# EAGLE design CA_kit_v02 (EAGLE 6.1)
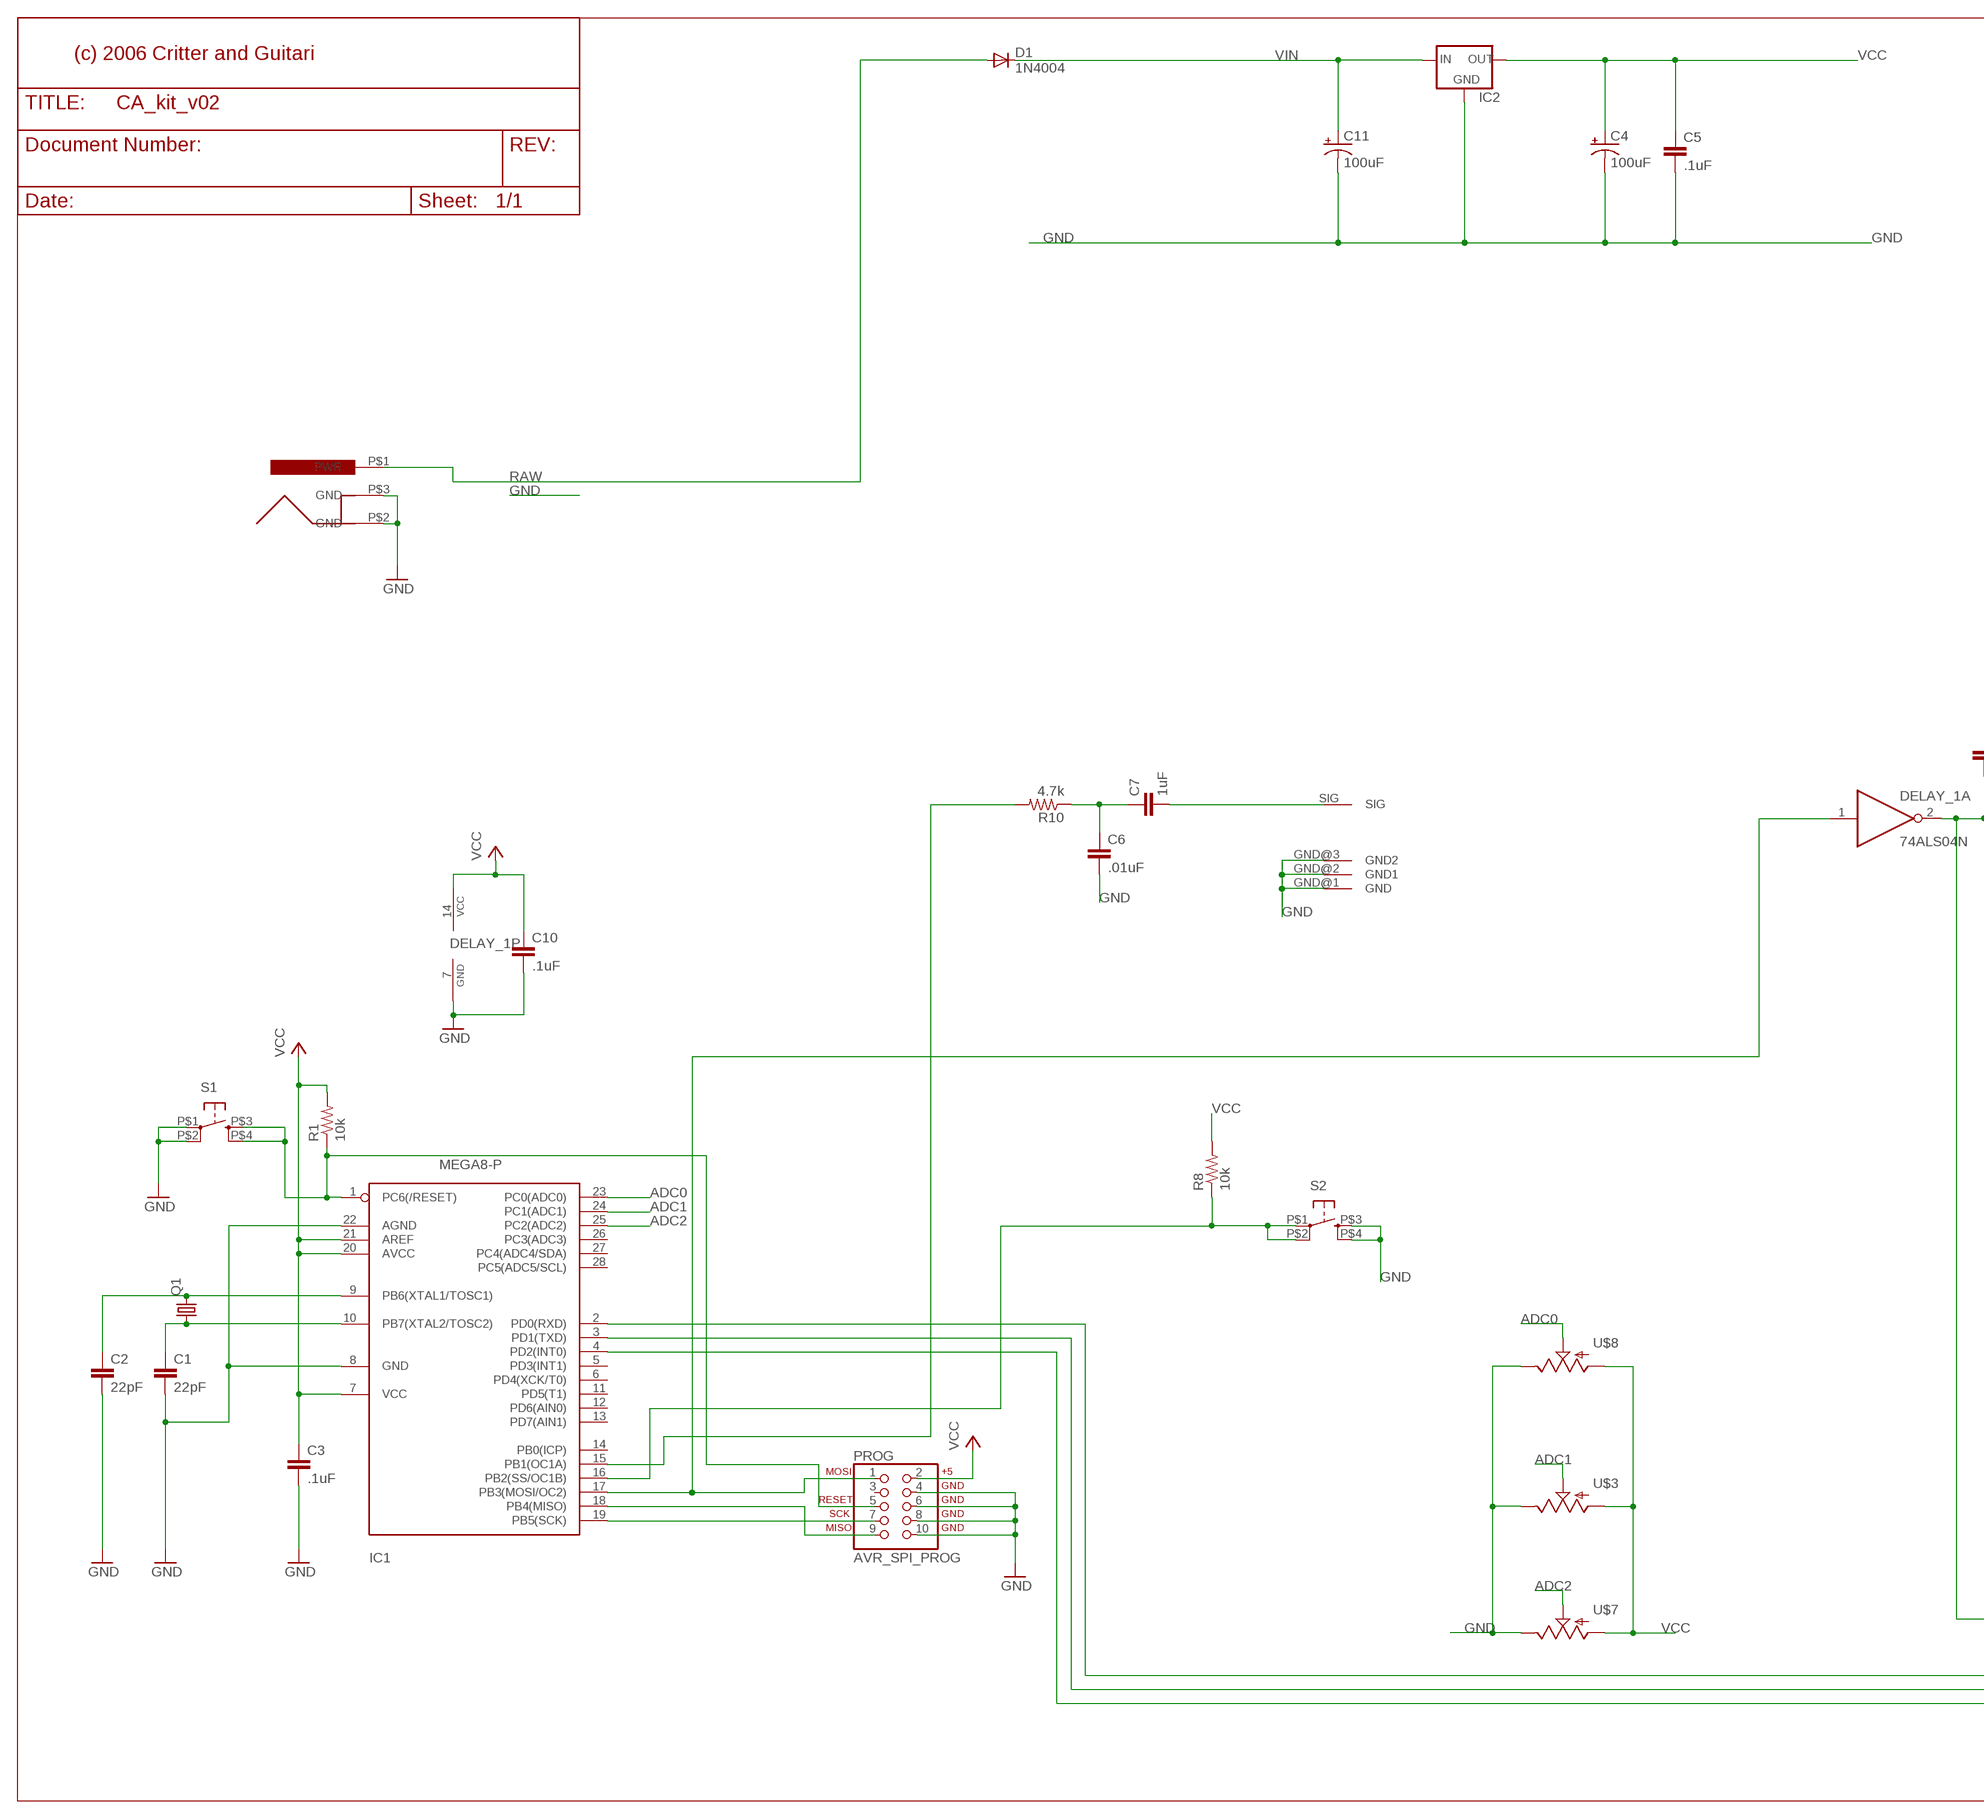
[diagram p0: schematic, sheet 1, part 1 of 2]
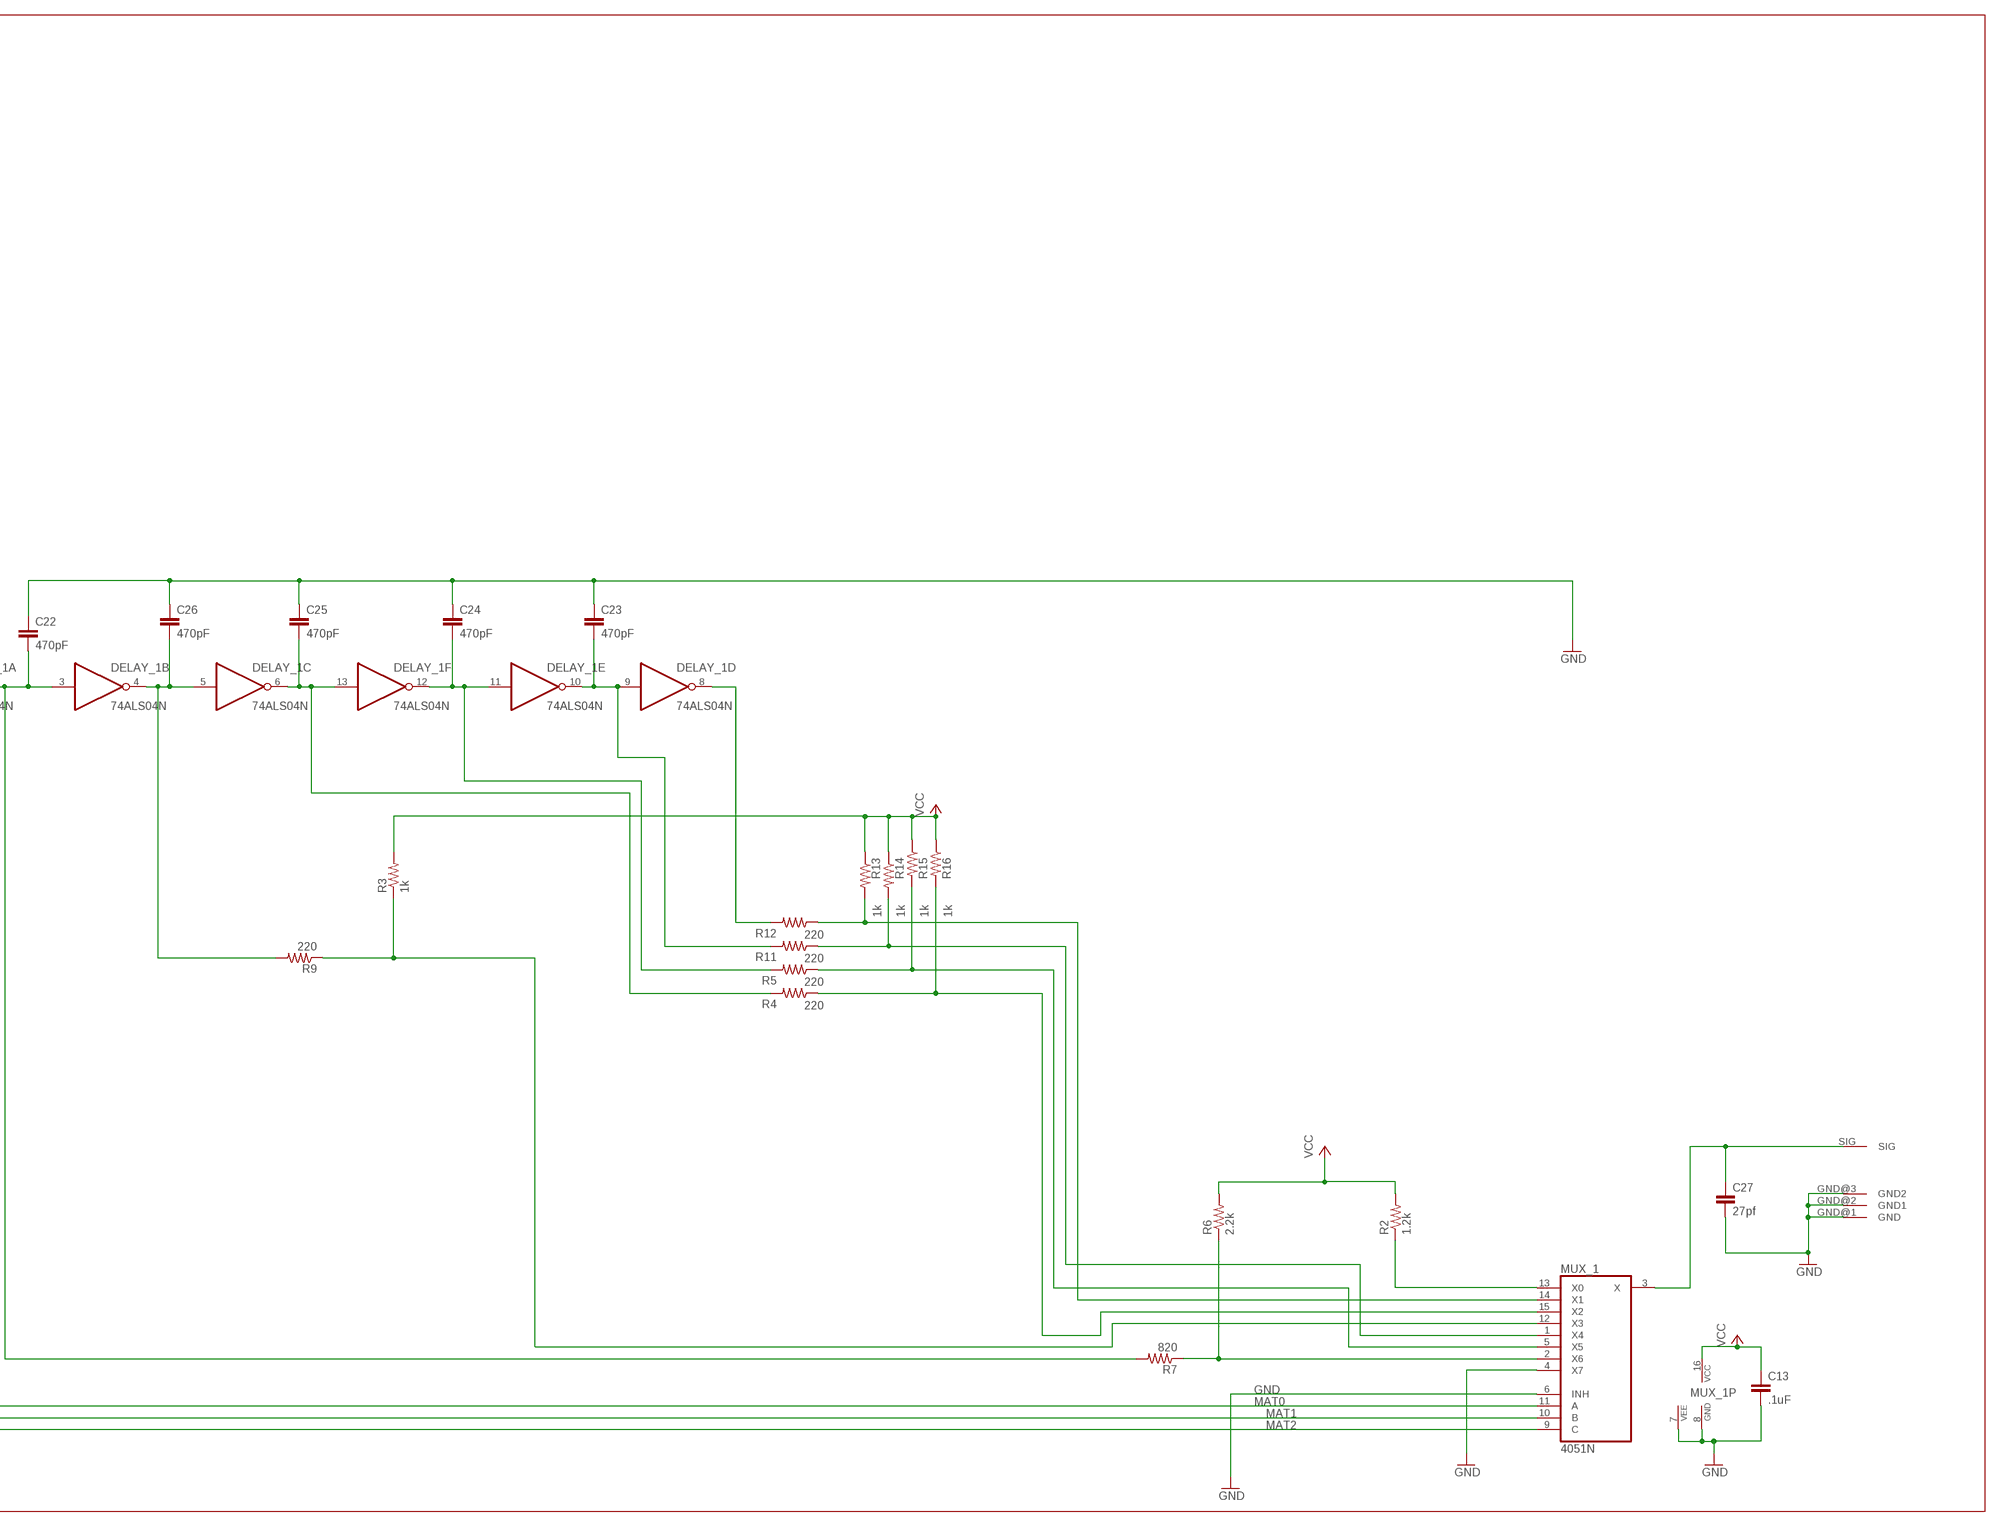
[diagram p1: schematic, sheet 1, part 2 of 2]

## Parts
C1  22pF  CAP025-025X050  [C025-025X050]
C2  22pF  CAP025-025X050  [C025-025X050]
C3  .1uF  CAP025-025X050  [C025-025X050]
C4  100uF  CPOL-USE3.5-8  [E3,5-8]
C5  .1uF  CAP025-025X050  [C025-025X050]
C6  .01uF  CAP025-025X050  [C025-025X050]
C7  1uF  CAP025-025X050  [C025-025X050]
C10  .1uF  CAP025-025X050  [C025-025X050]
C11  100uF  CPOL-USE3.5-8  [E3,5-8]
C13  .1uF  CAP025-025X050  [C025-025X050]
C22  470pF  CAP025-025X050  [C025-025X050]
C23  470pF  CAP025-025X050  [C025-025X050]
C24  470pF  CAP025-025X050  [C025-025X050]
C25  470pF  CAP025-025X050  [C025-025X050]
C26  470pF  CAP025-025X050  [C025-025X050]
C27  27pf  CAP025-025X050  [C025-025X050]
D1  1N4004  [DO41-10]
DELAY_1  74ALS04N  [DIL14]
IC1  MEGA8-P  [DIL28-3]
IC2  78XXS  [78XXS]
MUX_1  4051N  [DIL16]
PROG  AVR_SPI_PROG  [PINHEAD_2X05]
Q1  CRYSTALHC49UV  [HC49U-V]
R1  10k  RES0204V  [0204V]
R2  1.2k  RES0204V  [0204V]
R3  1k  RES0204V  [0204V]
R4  220  RES0204V  [0204V]
R5  220  RES0204V  [0204V]
R6  2.2k  RES0204V  [0204V]
R7  820  RES0204V  [0204V]
R8  10k  RES0204V  [0204V]
R9  220  RES0204V  [0204V]
R10  4.7k  RES0204V  [0204V]
R11  220  RES0204V  [0204V]
R12  220  RES0204V  [0204V]
R13  1k  RES0204V  [0204V]
R14  1k  RES0204V  [0204V]
R15  1k  RES0204V  [0204V]
R16  1k  RES0204V  [0204V]
S1  TAC_SWITCHKSA_SEALED_TAC_SWITCH  [KSA_SEALED_TAC_SWITCH]
S2  TAC_SWITCHKSA_SEALED_TAC_SWITCH  [KSA_SEALED_TAC_SWITCH]
U$1  POWER_JACK  POWER_JACKTHRU-HOLE  [POWER_JACK]
U$3  POT  [ALPS_POT]
U$5  PHONO_PLUG  [PHONO_PCB]
U$6  PHONO_PLUG  [PHONO_PCB]
U$7  POT  [ALPS_POT]
U$8  POT  [ALPS_POT]

## Nets
ADC0: IC1.23(PC0(ADC0)) U$8.P$2(S)
ADC1: IC1.24(PC1(ADC1)) U$3.P$2(S)
ADC2: IC1.25(PC2(ADC2)) U$7.P$2(S)
BURST: C22.2 DELAY_1.2(A:O) DELAY_1.3(B:I) R7.2
COLORS: DELAY_1.1(A:I) IC1.17(PB3(MOSI/OC2)) PROG.1
GND [power]: C1.2 C2.2 C3.2 C4.- C5.2 C6.2 C10.2 C11.- C13.2 C22.1 C23.1 C24.1 C25.1 C26.1 C27.2 DELAY_1.7(P:GND) IC1.8(GND) IC1.22(AGND) IC2.GND MUX_1.4(X7) MUX_1.6(INH) MUX_1.7(VEE) MUX_1.8(GND) PROG.4 PROG.6 PROG.8 PROG.10 S1.P$1(P) S1.P$2(P1) S2.P$3(S) S2.P$4(S1) U$1.P$2(GND) U$1.P$3(GND) U$3.P$1(E) U$5.GND@1(GND) U$5.GND@2(GND1) U$5.GND@3(GND2) U$6.GND@1(GND) U$6.GND@2(GND1) U$6.GND@3(GND2) U$7.P$1(E) U$8.P$1(E)
MAT0: IC1.2(PD0(RXD)) MUX_1.11(A)
MAT1: IC1.3(PD1(TXD)) MUX_1.10(B)
MAT2: IC1.4(PD2(INT0)) MUX_1.9(C)
N$1: IC1.16(PB2(SS/OC1B)) R8.1 S2.P$1(P) S2.P$2(P1)
N$2: DELAY_1.8(D:O) R12.2
N$3: C23.2 DELAY_1.9(D:I) DELAY_1.10(E:O) R11.2
N$4: C2.1 IC1.9(PB6(XTAL1/TOSC1)) Q1.2
N$5: C1.1 IC1.10(PB7(XTAL2/TOSC2)) Q1.1
N$6: IC1.15(PB1(OC1A)) R10.2
N$7: C26.2 DELAY_1.4(B:O) DELAY_1.5(C:I) R9.2
N$8: MUX_1.12(X3) R3.1 R9.1
N$9: C6.1 C7.1 R10.1
N$10 [power]: IC1.1(PC6(/RESET)) PROG.5 R1.1 S1.P$3(S) S1.P$4(S1)
N$11: C7.2 U$5.SIG
N$16: IC1.19(PB5(SCK)) PROG.7
N$17: IC1.18(PB4(MISO)) PROG.9
N$31: C25.2 DELAY_1.6(C:O) DELAY_1.13(F:I) R4.2
N$32: C24.2 DELAY_1.11(E:I) DELAY_1.12(F:O) R5.2
N$33: MUX_1.13(X0) R2.1
N$41: MUX_1.14(X1) R12.1 R13.2
N$42: MUX_1.1(X4) R11.1 R14.2
N$43: MUX_1.5(X5) R5.1 R15.2
N$44: MUX_1.15(X2) R4.1 R16.2
N$51: C27.1 MUX_1.3(X) U$6.SIG
N$55: MUX_1.2(X6) R6.1 R7.1
RAW: D1.A U$1.P$1(PWR)
VCC [power]: C3.1 C4.+ C5.1 C10.1 C13.1 DELAY_1.14(P:VCC) IC1.7(VCC) IC1.20(AVCC) IC1.21(AREF) IC2.OUT MUX_1.16(VCC) PROG.2 R1.2 R2.2 R3.2 R6.2 R8.2 R13.1 R14.1 R15.1 R16.1 U$3.P$3(A) U$7.P$3(A) U$8.P$3(A)
VIN [power]: C11.+ D1.C IC2.IN
Unconnected: IC1.5(PD3(INT1)) IC1.6(PD4(XCK/T0)) IC1.11(PD5(T1)) IC1.12(PD6(AIN0)) IC1.13(PD7(AIN1)) IC1.14(PB0(ICP)) IC1.26(PC3(ADC3)) IC1.27(PC4(ADC4/SDA)) IC1.28(PC5(ADC5/SCL)) PROG.3

## Notes on the sheet
- (c) 2006 Critter and Guitari

## Library data of the parts
C1-C3 C5-C7 C10 C13 C22-C27 = SparkFun:CAP: CAPACITOR
C4 C11 = rcl:CPOL-US: POLARIZED CAPACITOR, American symbol
D1 = diode:1N4004: DIODE general purpose rectifier, 1 A
DELAY_1 = 74xx-us:74*04: Hex INVERTER
IC1 = avr:MEGA8-P: MICROCONTROLLER 8 Kbytes FLASH 1 kbytes SRAM 512 bytes EEPROM USART 4-channel 10 bit ADC 2-channel 8 bit ADC
IC2 = v-reg:78XXS: VOLTAGE REGULATOR
MUX_1 = 40xx:4051: 8-channel ANALOG MULTIPLEXER
PROG = SparkFun:AVR_SPI_PROG: PIN HEADER
Q1 = SparkFun:CRYSTAL
R1-R16 = SparkFun:RES: RESISTOR
S1 S2 = SparkFun:TAC_SWITCH: OMRON SWITCH
U$1 = SparkFun:POWER_JACK
U$3 U$7 U$8 = sfe_owen:POT
U$5 U$6 = sfe_owen:PHONO_PLUG

## Net classes
0 default: width 0.254 mm
1 power: width 0.254 mm

## Board
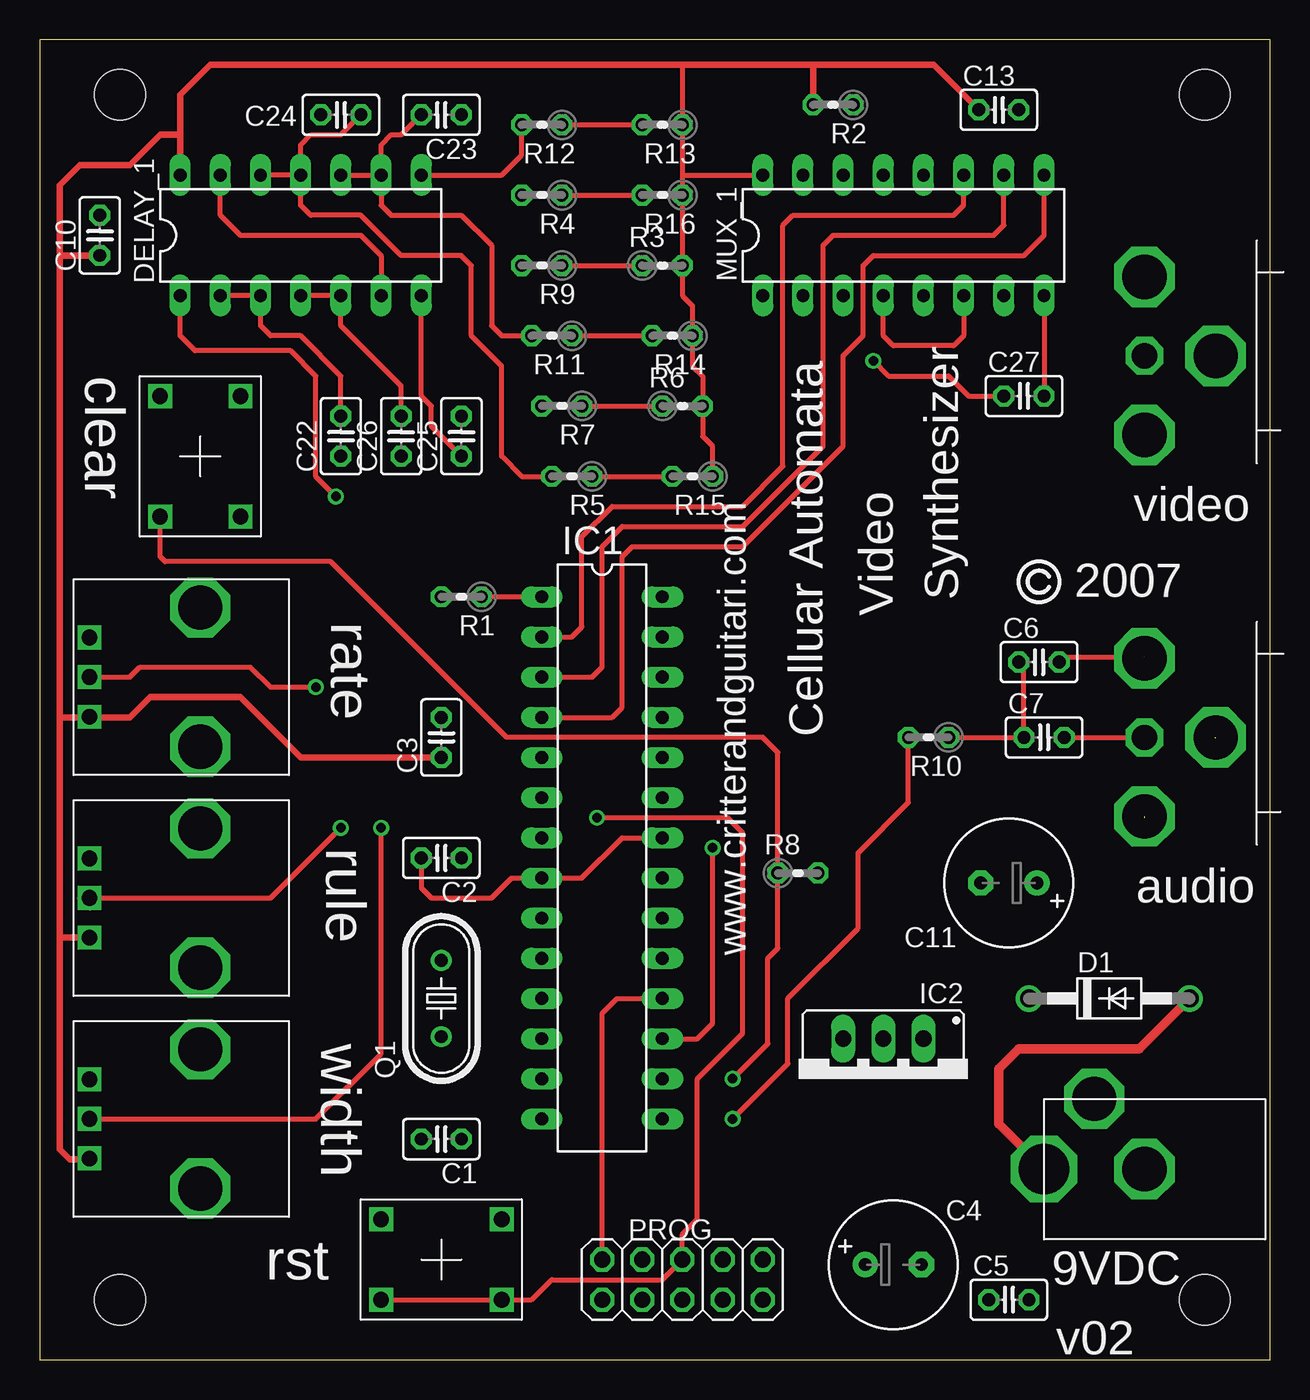
[diagram p2: board, top side]
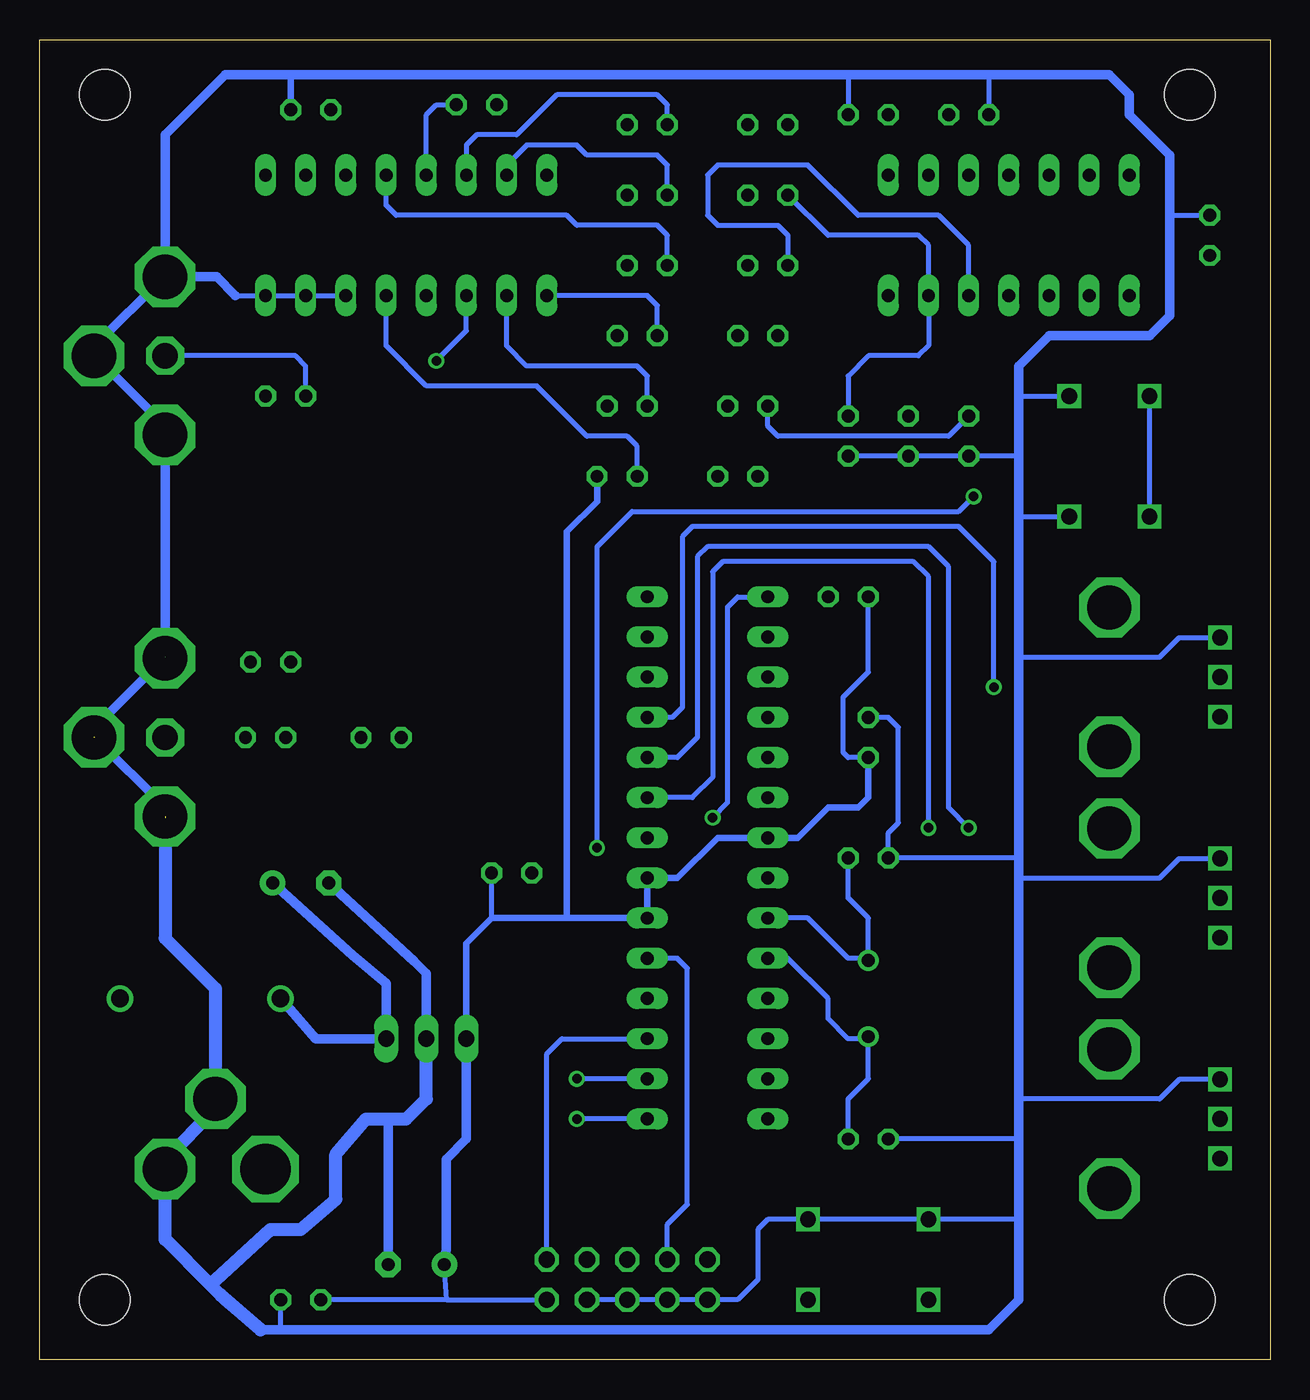
[diagram p3: board, bottom side, seen from below]

Size 77.79 x 83.5 mm. Coordinates in mm from the lower left corner, seen from the top.
Outline: 0,0 77.79,0 77.79,83.5 0,83.5 0,0
Copper layers (1*16): Top 0.0356mm / dielectric 1.5011mm / Bottom 0.0356mm
Design rules: minimum track width 12mil, minimum drill 20mil, track to track 12mil, track to pad 12mil, pad to pad 12mil, via to via 12mil, smd to smd 12mil, copper to edge 30mil, drill to drill 8mil, minimum pad ring 10mil, minimum via ring 8mil, stop-mask expansion 4mil, vias tented up to drill 0mil, thermal gap 10mil
Holes 3.2 mm at 73.66,80.01 5.08,80.01 73.66,3.81 5.08,3.81

### Footprints (pad centres in the part's own frame; a part is rotated, then mirrored left to right if it is on the bottom)
C025-025X050 = drill 0.813 octagon: 1 -1.27,0; 2 1.27,0
E3,5-8 = drill 0.813 pad 1.6: + -1.778,0 | drill 0.813 pad 1.6 octagon: - 1.778,0
DO41-10 = drill 1.118: A 5.08,0; C -5.08,0
DIL14 = drill 0.813 long: 1 -7.62,-3.81; 2 -5.08,-3.81; 3 -2.54,-3.81; 4 0,-3.81; 5 2.54,-3.81; 6 5.08,-3.81; 7 7.62,-3.81; 8 7.62,3.81; 9 5.08,3.81; 10 2.54,3.81; 11 0,3.81; 12 -2.54,3.81; 13 -5.08,3.81; 14 -7.62,3.81
DIL28-3 = drill 0.813 long: 1 -16.51,-3.81; 2 -13.97,-3.81; 3 -11.43,-3.81; 4 -8.89,-3.81; 5 -6.35,-3.81; 6 -3.81,-3.81; 7 -1.27,-3.81; 8 1.27,-3.81; 9 3.81,-3.81; 10 6.35,-3.81; 11 8.89,-3.81; 12 11.43,-3.81; 13 13.97,-3.81; 14 16.51,-3.81; 15 16.51,3.81; 16 13.97,3.81; 17 11.43,3.81; 18 8.89,3.81; 19 6.35,3.81; 20 3.81,3.81; 21 1.27,3.81; 22 -1.27,3.81; 23 -3.81,3.81; 24 -6.35,3.81; 25 -8.89,3.81; 26 -11.43,3.81; 27 -13.97,3.81; 28 -16.51,3.81
78XXS = drill 1.016 long: GND 0,-2.54; IN -2.54,-2.54; OUT 2.54,-2.54
DIL16 = drill 0.813 long: 1 -8.89,-3.81; 2 -6.35,-3.81; 3 -3.81,-3.81; 4 -1.27,-3.81; 5 1.27,-3.81; 6 3.81,-3.81; 7 6.35,-3.81; 8 8.89,-3.81; 9 8.89,3.81; 10 6.35,3.81; 11 3.81,3.81; 12 1.27,3.81; 13 -1.27,3.81; 14 -3.81,3.81; 15 -6.35,3.81; 16 -8.89,3.81
PINHEAD_2X05 = drill 1.016 octagon: 1 -1.27,5.08; 2 1.27,5.08; 3 -1.27,2.54; 4 1.27,2.54; 5 -1.27,0; 6 1.27,0; 7 -1.27,-2.54; 8 1.27,-2.54; 9 -1.27,-5.08; 10 1.27,-5.08
HC49U-V = drill 0.813: 1 -2.413,0; 2 2.413,0
0204V = drill 0.813 octagon: 1 -1.27,0; 2 1.27,0
KSA_SEALED_TAC_SWITCH = drill 1 square: P$1 -3.81,2.54; P$2 3.81,2.54; P$3 -3.81,-2.54; P$4 3.81,-2.54
POWER_JACK = drill 3.2 octagon: P$1 0,4.445 | drill 2.8 octagon: P$2 3.175,8.89; P$3 6.35,4.445
ALPS_POT = drill 1 square: P$1 7,-2.5; P$2 7,0; P$3 7,2.5 | drill 2.8 octagon: P$4 0,-4.4; P$5 0,4.4
PHONO_PCB = drill 2.8 octagon: GND@1 0,5; GND@2 0,-5; GND@3 4.5,0 | drill 1.6 octagon: SIG 0,0

### Placement (x,y rotation side)
C1  25.4,13.97 180 top
C2  25.4,31.75 180 top
C3  25.4,39.37 90 top
C4  53.98,6.03 0 top
C5  61.28,3.81 0 top
C6  63.18,44.13 0 top
C7  63.5,39.37 0 top
C10  3.81,71.12 90 top
C11  61.28,30.16 180 top
C13  60.64,79.06 0 top
C22  19.05,58.42 90 top
C23  25.4,78.74 180 top
C24  19.05,78.74 0 top
C25  26.67,58.42 90 top
C26  22.86,58.42 90 top
C27  62.23,60.96 0 top
D1  67.63,22.86 0 top
DELAY_1  16.51,71.12 0 top
IC1  35.56,31.75 270 top
IC2  53.34,17.78 180 top
MUX_1  54.61,71.12 0 top
PROG  40.64,5.08 270 top
Q1  25.4,22.86 90 top
R1  26.67,48.26 180 top
R2  50.16,79.38 180 top
R3  39.37,69.22 0 top
R4  31.75,73.66 180 top
R5  33.66,55.88 180 top
R6  40.64,60.33 0 top
R7  33.02,60.33 180 top
R8  47.94,30.8 0 top
R9  31.75,69.22 180 top
R10  56.2,39.37 180 top
R11  32.38,64.77 180 top
R12  31.75,78.11 180 top
R13  39.37,78.11 180 top
R14  40.01,64.77 180 top
R15  41.27,55.88 180 top
R16  39.37,73.66 180 top
S1  25.4,6.35 0 top
S2  10.16,57.15 90 top
U$1  63.5,7.62 0 top
U$3  10.16,29.21 180 top
U$5  69.85,39.37 0 top
U$6  69.85,63.5 0 top
U$7  10.16,43.18 180 top
U$8  10.16,15.24 180 top

### Tracks (layer width: path | path; a pad name or v marks a point on that pad's centre or on a via)
ADC0  (via drill 0.6)
  Top 0.305: v21.59,33.66 21.59,19.37 17.46,15.24 3.49,15.24 3.17,14.92 3.16,14.94 U$8.P$2
  Bottom 0.305: IC1.23 36.51,35.56 35.24,36.83 35.24,49.85 34.61,50.48 22.54,50.48 21.59,49.53 v21.59,33.66
ADC1  (via drill 0.6)
  Top 0.305: v19.05,33.66 14.61,29.21 3.81,29.21 3.17,28.57 2.54,29.21 U$3.P$2 3.17,29.21
  Bottom 0.305: IC1.24 37.47,38.1 36.2,39.37 36.2,50.8 35.56,51.44 21.59,51.44 20.32,50.16 20.32,34.92 v19.05,33.66
ADC2  (via drill 0.6)
  Top 0.305: v17.46,42.55 14.61,42.55 13.34,43.81 6.35,43.81 5.71,43.18 U$7.P$2
  Bottom 0.305: IC1.25 37.78,40.64 37.15,41.27 37.15,52.07 36.51,52.7 19.68,52.7 17.46,50.48 v17.46,42.55
BURST
  Top 0.305: DELAY_1.2 DELAY_1.3 13.97,65.41 14.61,64.77 16.51,64.77 19.05,62.23 C22.2
  Bottom 0.305: R7.2 31.75,59.05 31.11,58.42 20.32,58.42 C22.2
COLORS  (via drill 0.6)
  Top 0.305: IC1.17 41.59,20.32 42.55,21.27 v42.55,32.38 | v18.73,54.61 17.46,55.88 17.46,62.23 15.88,63.82 9.84,63.82 8.89,64.77 DELAY_1.1 8.89,67.63
  Bottom 0.305: v42.55,32.38 42.55,51.44 40.32,53.66 19.68,53.66 v18.73,54.61 | PROG.1 45.72,19.37 44.77,20.32 IC1.17
GND  (3 unrouted)
  Top 0.305: C2.2 24.13,29.84 24.77,29.21 28.57,29.21 29.84,30.48 IC1.8 34.29,30.48 36.83,33.02 IC1.22 | DELAY_1.7 24.13,60.96 24.77,60.33 24.77,59.05 C25.1 | MUX_1.4 53.34,64.77 53.98,64.14 57.78,64.14 58.42,64.77 MUX_1.6 | MUX_1.8 C27.2 | U$5.GND@1 69.85,44.45 64.77,44.45 C6.2
  Bottom 0.305: 65.41,67.31 MUX_1.8 MUX_1.7 MUX_1.6 | 17.78,81.28 C24.1 | 26.67,81.28 C23.1 | 6.35,72.39 C10.2 | 15.88,57.15 C22.1 C26.1 C25.1 | U$7.P$1 5.75,45.68 6.99,44.45 15.88,44.45 | U$3.P$1 5.75,31.71 6.99,30.48 15.88,30.48 | 15.88,31.75 C2.2 24.13,33.34 23.5,33.97 23.5,40.01 24.13,40.64 C3.2 | 15.88,13.97 C1.2 | U$8.P$1 5.75,17.74 6.99,16.51 15.88,16.51 | 15.88,8.89 S1.P$1 S1.P$2 31.75,8.89 32.38,8.26 32.38,5.08 33.66,3.81 PROG.10 PROG.8 PROG.6 PROG.4 | 62.55,1.91 C5.2 | 15.88,60.96 S2.P$4 | 15.88,53.34 S2.P$3
  Bottom 0.406: 61.91,81.28 C13.2
  Bottom 0.61: 69.85,34.29 69.85,34.92 74.3,39.37 74.3,40.01 69.85,44.45 U$6.GND@2 69.85,59.05 74.3,63.5 U$6.GND@3 74.35,64.08 69.85,68.58 | 65.41,67.31 66.59,68.5 U$6.GND@1 69.85,68.58 | 69.85,68.58 70.48,68.58 69.85,69.22 69.85,77.47 66.04,81.28 61.91,81.28 26.67,81.28 17.78,81.28 10.16,81.28 8.89,80.01 8.89,78.74 6.35,76.2 6.35,72.39 6.35,66.04 7.62,64.77 13.97,64.77 15.88,62.87 15.88,60.96 15.88,57.15 15.88,53.34 15.88,44.45 15.88,31.75 15.88,30.48 15.88,16.51 15.88,13.97 15.88,8.89 15.88,3.81 17.78,1.91 62.55,1.91 63.82,1.91 | C11.- 54.1,25.21 53.34,24.45 IC2.GND | C4.- 55.75,15.11 55.24,15.24
  Bottom 0.813: U$1.P$2 66.67,15.88 69.85,12.7 U$1.P$3 69.85,7.62 66.99,4.76 | 66.36,4.13 66.04,3.81 63.82,1.91 66.36,4.13 | 66.36,4.13 66.99,4.76 | 66.99,4.76 63.18,8.26 61.28,8.26 59.05,10.16 59.05,13.02 57.15,15.24 55.24,15.24 54.61,15.24 53.34,16.51 IC2.GND | 69.85,34.29 69.85,26.67 66.67,23.5 66.67,17.14
MAT0
  Top 0.305: IC1.2 33.66,45.72 34.29,46.35 34.29,52.07 36.2,53.98 44.45,53.98 46.99,56.52 46.99,71.75 47.62,72.39 57.78,72.39 58.42,73.03 MUX_1.11
MAT1
  Top 0.305: IC1.3 34.92,43.18 35.56,43.81 35.56,51.44 36.83,52.7 44.45,52.7 49.53,57.78 49.53,70.48 50.16,71.12 60.33,71.12 60.96,71.75 MUX_1.10
MAT2
  Top 0.305: IC1.4 36.2,40.64 36.83,41.27 36.83,50.8 37.47,51.44 44.45,51.44 50.8,57.78 50.8,63.5 52.07,64.77 52.07,69.22 52.7,69.85 62.23,69.85 63.5,71.12 MUX_1.9
N$1  (via drill 0.6)
  Top 0.305: v43.81,17.78 46.04,20 46.04,25.4 46.67,26.04 R8.1 46.67,38.42 45.72,39.37 29.53,39.37 18.41,50.48 7.94,50.48 7.62,50.8 S2.P$1
  Bottom 0.305: IC1.16 v43.81,17.78 | S2.P$1 S2.P$2
N$2
  Top 0.305: R12.2 30.48,76.2 29.21,74.93 DELAY_1.8
N$3
  Top 0.305: DELAY_1.10 DELAY_1.9 | DELAY_1.9 21.59,76.83 22.23,77.47 22.86,77.47 C23.2 | DELAY_1.9 21.59,73.03 22.23,72.39 26.67,72.39 28.57,70.48 28.57,65.41 29.21,64.77 R11.2
N$4
  Bottom 0.305: 25.4,25.4 25.4,27.94 26.67,29.21 C2.1 | IC1.9 29.21,27.94 26.67,25.4 25.4,25.4 | Q1.2 25.4,25.4
N$5
  Bottom 0.305: 25.4,20.32 25.4,17.78 26.67,16.51 C1.1 | IC1.10 30.48,25.4 27.94,22.86 27.94,21.59 26.67,20.32 25.4,20.32 | 25.4,20.32 Q1.1
N$6  (via drill 0.6)
  Top 0.305: v43.81,15.24 47.31,18.73 47.31,22.86 51.75,27.3 51.75,32.07 54.93,35.24 R10.2
  Bottom 0.305: IC1.15 v43.81,15.24
N$7
  Top 0.305: DELAY_1.4 DELAY_1.5 19.05,65.41 22.86,61.59 C26.2
  Bottom 0.305: R9.2 30.48,71.12 31.11,71.75 34.92,71.75 35.56,72.39 35.56,74.93 34.92,75.56 29.21,75.56 26.04,72.39 20.95,72.39 19.05,70.48 DELAY_1.5
N$8
  Top 0.305: R9.1 R3.1
  Bottom 0.305: R3.1 38.1,71.12 38.73,71.75 43.81,71.75 44.45,72.39 55.24,72.39 55.88,73.03 MUX_1.12
N$9
  Top 0.305: R10.1 C7.1 62.23,43.81 C6.1
N$10  (via drill 0.6)
  Top 0.305: IC1.1 R1.1 | v35.24,34.29 43.5,34.29 44.45,33.34 44.45,20.64 41.59,17.78 41.59,8.89 40.64,7.94 40.64,6.67 40.32,6.35 | 40.32,6.35 PROG.5 | 40.32,6.35 40.32,6.03 39.37,5.08 32.38,5.08 31.11,3.81 S1.P$4 | S1.P$4 28.89,3.81 | S1.P$3 S1.P$4
  Bottom 0.305: IC1.1 33.66,48.26 34.29,47.62 34.29,35.24 v35.24,34.29
N$11
  Top 0.305: C7.2 U$5.SIG
N$16
  Bottom 0.305: IC1.19 37.47,25.4 36.83,24.77 36.83,9.84 38.1,8.57 PROG.7 | PROG.7 38.1,6.03 | PROG.7 38.42,6.35 38.1,6.03 | 38.1,6.03 38.1,5.71
N$17
  Top 0.305: IC1.18 36.51,22.86 35.56,21.91 PROG.9
N$31
  Top 0.305: DELAY_1.13 11.43,72.39 12.7,71.12 20.32,71.12 21.59,69.85 DELAY_1.6
  Bottom 0.305: R4.2 27.94,71.12 22.23,71.12 21.59,70.48 DELAY_1.6 21.59,64.14 22.23,63.5 25.4,63.5 26.67,62.23 C25.2
N$32
  Top 0.305: DELAY_1.11 DELAY_1.12 | DELAY_1.11 16.51,76.83 17.14,77.47 19.05,77.47 C24.2 | DELAY_1.11 16.51,73.03 17.14,72.39 20.32,72.39 22.86,69.85 26.67,69.85 27.3,69.22 27.3,64.77 29.21,62.87 29.21,57.15 30.48,55.88 R5.2
N$33
  Bottom 0.305: MUX_1.13 53.34,78.74 52.7,79.38 R2.1
N$41
  Top 0.305: R12.1 R13.2
  Bottom 0.305: R13.2 38.1,79.38 38.73,80.01 45.09,80.01 47.62,77.47 50.16,77.47 50.8,76.83 MUX_1.14
N$42
  Top 0.305: R11.1 R14.2
  Bottom 0.305: R14.2 38.73,66.67 39.37,67.31 MUX_1.1
N$43
  Top 0.305: R5.1 R15.2
  Bottom 0.305: R15.2 40.01,57.78 40.64,58.42 43.18,58.42 46.35,61.59 53.34,61.59 55.88,64.14 MUX_1.5
N$44
  Top 0.305: R4.1 R16.2
  Bottom 0.305: R16.2 38.1,75.56 38.73,76.2 43.18,76.2 43.81,76.83 46.99,76.83 48.26,75.56 MUX_1.15 48.26,74.3
N$51  (via drill 0.6)
  Top 0.305: C27.1 58.74,60.96 57.47,62.23 53.66,62.23 v52.7,63.18
  Bottom 0.305: C27.1 60.96,62.87 61.59,63.5 U$6.SIG | v52.7,63.18 50.8,65.09 MUX_1.3
N$55
  Top 0.305: R7.1 R6.1
  Bottom 0.305: R6.1 39.37,62.23 40.01,62.87 46.99,62.87 48.26,64.14 MUX_1.2
RAW
  Top 0.61: U$1.P$1 60.64,14.92 60.64,18.41 61.91,19.68 69.53,19.68 D1.A
VCC
  Top 0.305: 42.55,55.56 R15.1 42.55,57.78 41.91,58.42 R6.2 41.91,62.23 41.27,62.87 R14.1 41.27,66.67 40.64,67.31 R3.2 R16.1 40.64,74.93 | 40.64,81.92 R13.1 40.64,74.93 | 40.64,74.93 MUX_1.16
  Top 0.406: C3.1 16.51,38.1 12.7,41.91 6.99,41.91 5.71,40.64 3.17,40.64 | 3.17,40.64 3.16,40.66 U$7.P$3 | 1.27,40.64 3.17,40.64 | U$8.P$3 3.16,12.71 3.17,12.7 1.91,12.7 1.27,13.34 1.27,26.67 | 1.27,26.67 1.27,40.64 | U$3.P$3 1.31,26.71 1.27,26.67 | 1.27,40.64 1.27,69.85 | 1.27,69.85 C10.1 | 1.27,69.85 1.27,74.3 2.54,75.56 5.71,75.56 7.62,77.47 8.89,77.47 | 8.89,77.47 8.89,80.01 10.79,81.92 40.64,81.92 48.9,81.92 | 8.89,77.47 DELAY_1.14 | 48.9,81.92 R2.2 | 48.9,81.92 56.52,81.92 C13.1
  Bottom 0.305: R1.2 25.4,43.5 26.99,41.91 26.99,38.42 26.67,38.1 C3.1 25.08,38.1 | C4.+ 52.2,5.59 52.07,3.81 | 52.07,3.81 C5.1 | 52.07,3.81 PROG.2 | 49.21,27.94 R8.2
  Bottom 0.406: IC2.OUT 50.8,26.35 49.21,27.94 44.45,27.94 | IC1.20 44.45,27.94 | IC1.20 38.73,27.94 | IC1.20 IC1.21 37.47,30.48 34.92,33.02 IC1.7 29.84,33.02 27.94,34.92 26.04,34.92 25.4,35.56 C3.1 | 44.45,27.94 44.45,51.12 | 44.45,51.12 44.45,51.44 | R15.1 42.55,54.29 44.45,52.39 44.45,51.12
  Bottom 0.61: IC2.OUT 50.8,13.97 52.07,12.7 52.07,6.99 52.2,6.16 C4.+
VIN
  Bottom 0.61: C11.+ 57.98,25.59 55.88,23.81 IC2.IN 60.33,20.32 D1.C

### Text on the board
tPlace: Synthesizer | Celluar Automata | clear | Video | video | www.critterandguitari.com | 2007 | rate | rule | audio | width | rst | 9VDC | v02